# Altium schematic sheet Sheet1.SchDoc
size A4
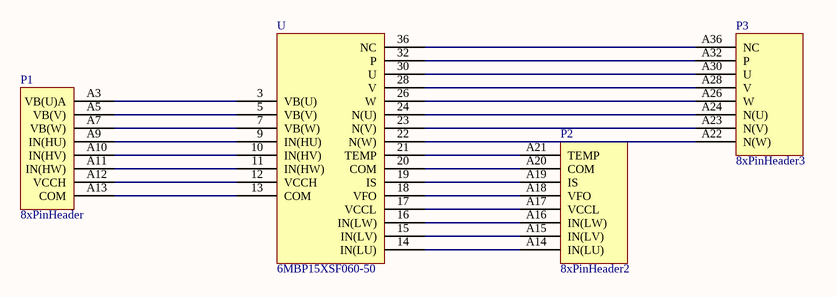
[diagram p0: Sheet1.SchDoc]

## Parts
P1  8xPinHeader  [8xPinHeader]
P2  8xPinHeader2  [8xPİNHEADER2]
P3  8xPinHeader3  [8xPİNHEADER3]
U  6MBP15XSF060-50  [6MBP15XSF060-50]

## Nets
NetP1_A3: P1.A3(VB(U)A) U.3(VB(U))
NetP1_A5: P1.A5(VB(V)) U.5(VB(V))
NetP1_A7: P1.A7(VB(W)) U.7(VB(W))
NetP1_A9: P1.A9(IN(HU)) U.9(IN(HU))
NetP1_A10: P1.A10(IN(HV)) U.10(IN(HV))
NetP1_A11: P1.A11(IN(HW)) U.11(IN(HW))
NetP1_A12: P1.A12(VCCH) U.12(VCCH)
NetP1_A13: P1.A13(COM) U.13(COM)
NetP2_A14: P2.A14(IN(LU)) U.14(IN(LU))
NetP2_A15: P2.A15(IN(LV)) U.15(IN(LV))
NetP2_A16: P2.A16(IN(LW)) U.16(IN(LW))
NetP2_A17: P2.A17(VCCL) U.17(VCCL)
NetP2_A18: P2.A18(VFO) U.18(VFO)
NetP2_A19: P2.A19(IS) U.19(IS)
NetP2_A20: P2.A20(COM) U.20(COM)
NetP2_A21: P2.A21(TEMP) U.21(TEMP)
NetP3_A22: P3.A22(N(W)) U.22(N(W))
NetP3_A23: P3.A23(N(V)) U.23(N(V))
NetP3_A24: P3.A24(N(U)) U.24(N(U))
NetP3_A26: P3.A26(W) U.26(W)
NetP3_A28: P3.A28(V) U.28(V)
NetP3_A30: P3.A30(U) U.30(U)
NetP3_A32: P3.A32(P) U.32(P)
NetP3_A36: P3.A36(NC) U.36(NC)

## Library data of the parts
U = 6MBP15XSF060-50: 600v 15a